# Altium project GameBoard_V1I1.PrjPcb (part 6 of 20)

## Sheet [18] - PCIE MINI.SchDoc
size A2; DocumentNumber: 18; SheetNumber: 18; SheetTotal: 32
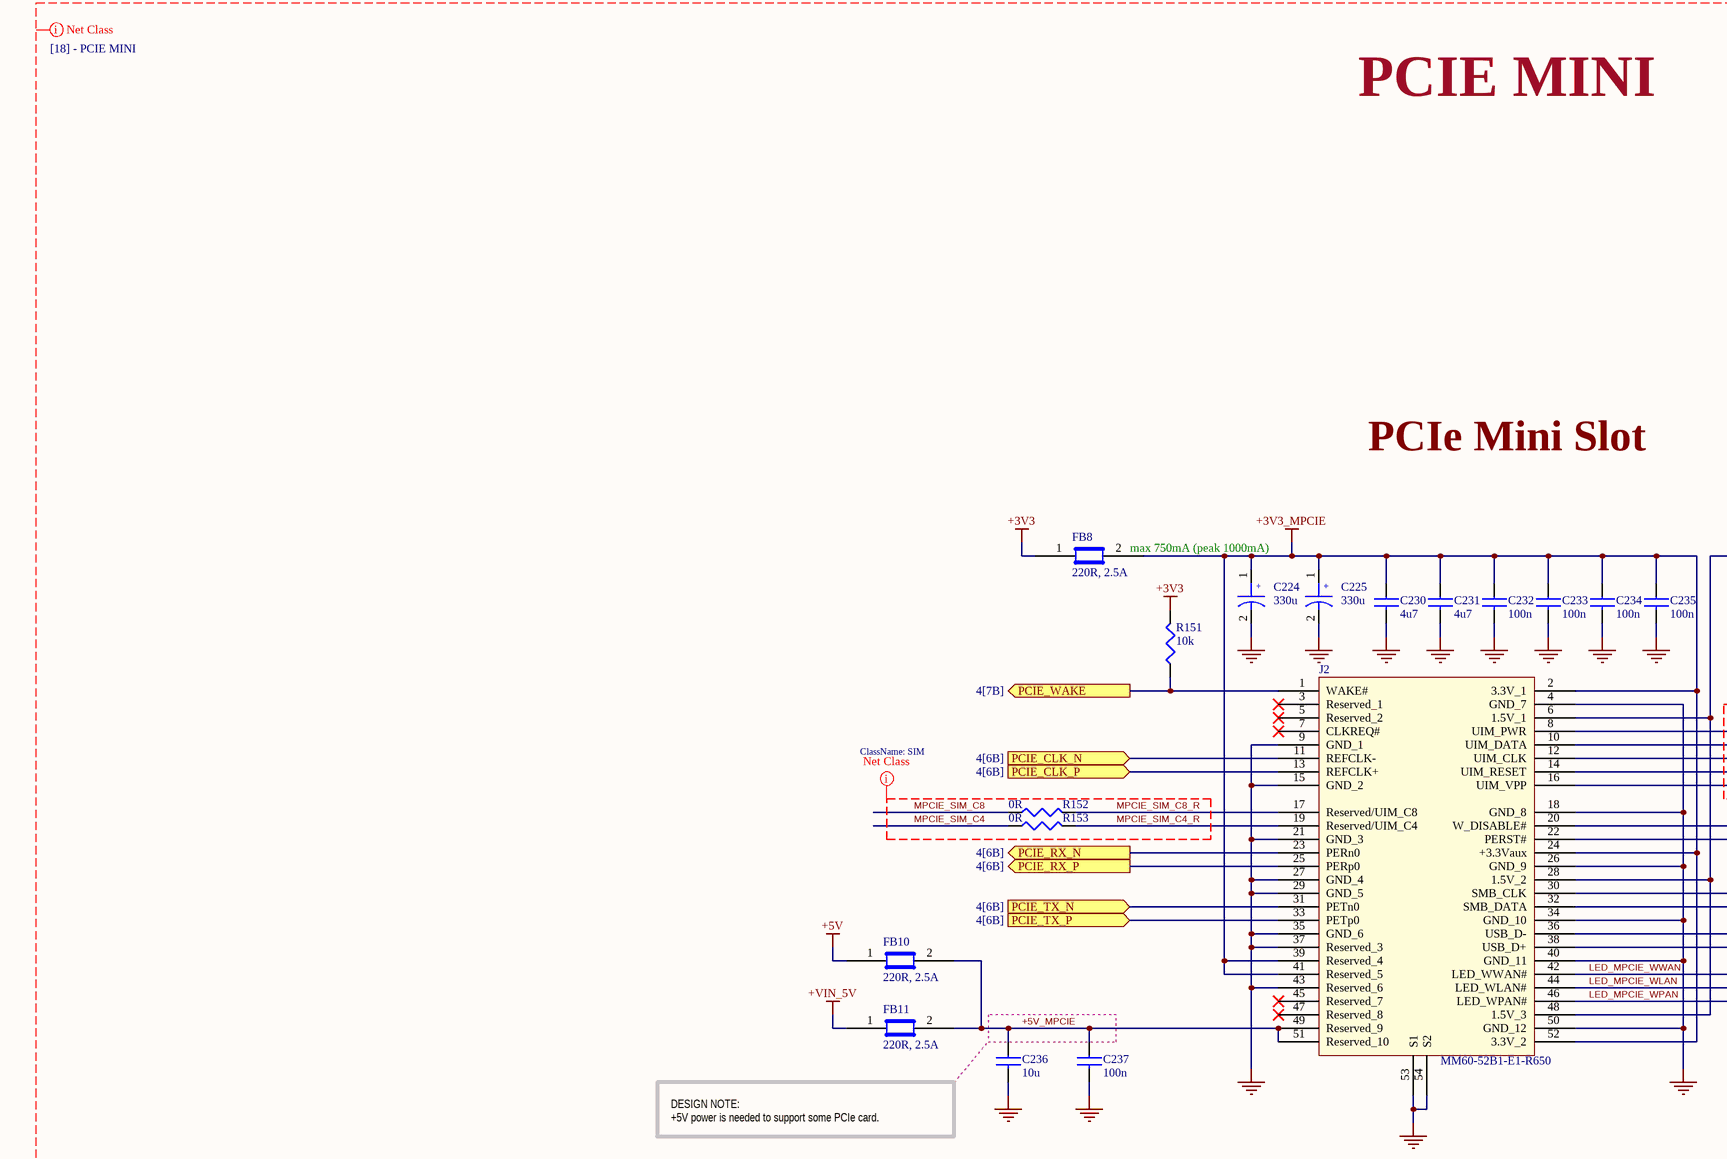
[diagram p37: [18] - PCIE MINI.SchDoc, top left]
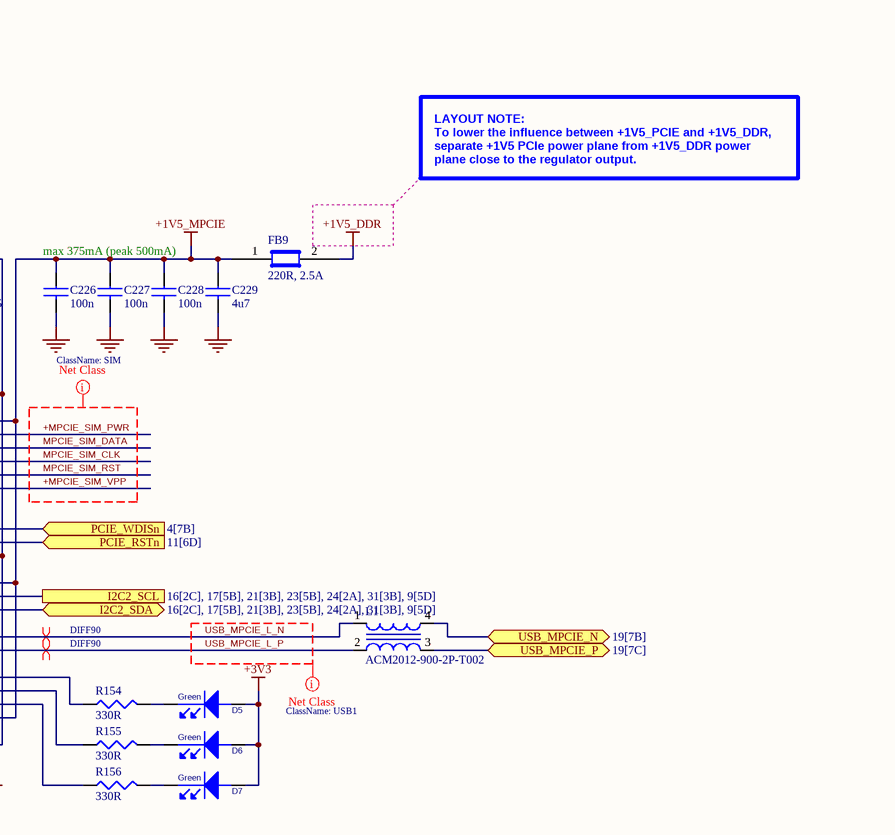
[diagram p38: [18] - PCIE MINI.SchDoc, top right]
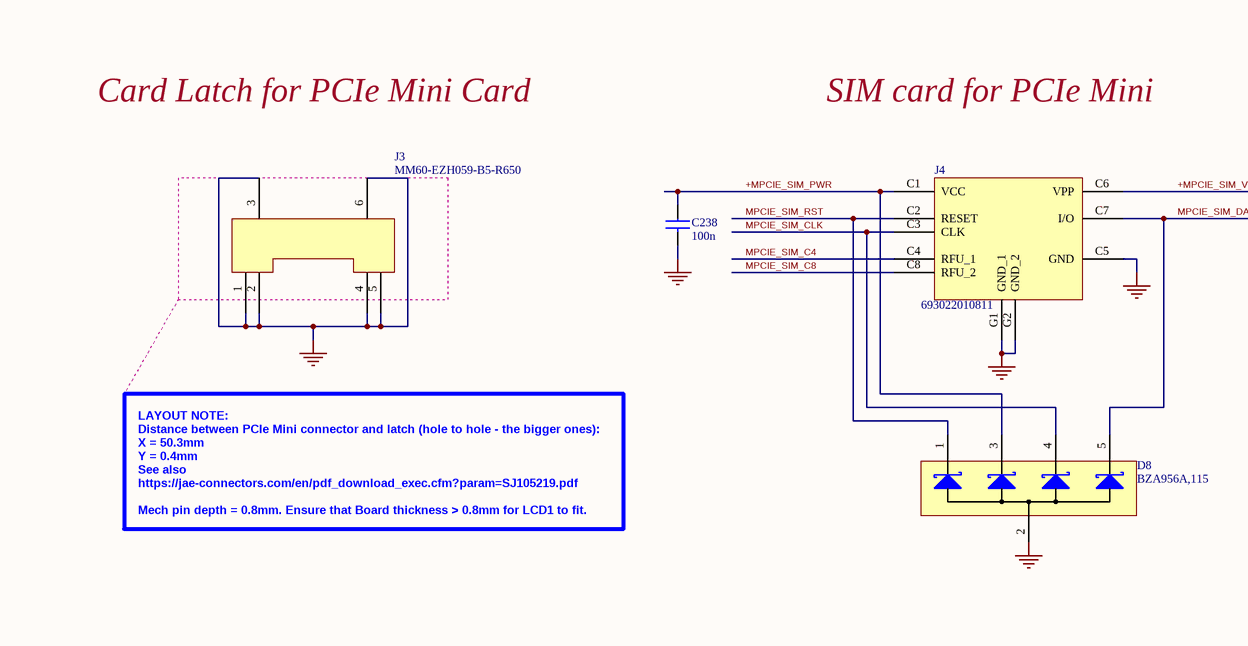
[diagram p39: [18] - PCIE MINI.SchDoc, bottom left]
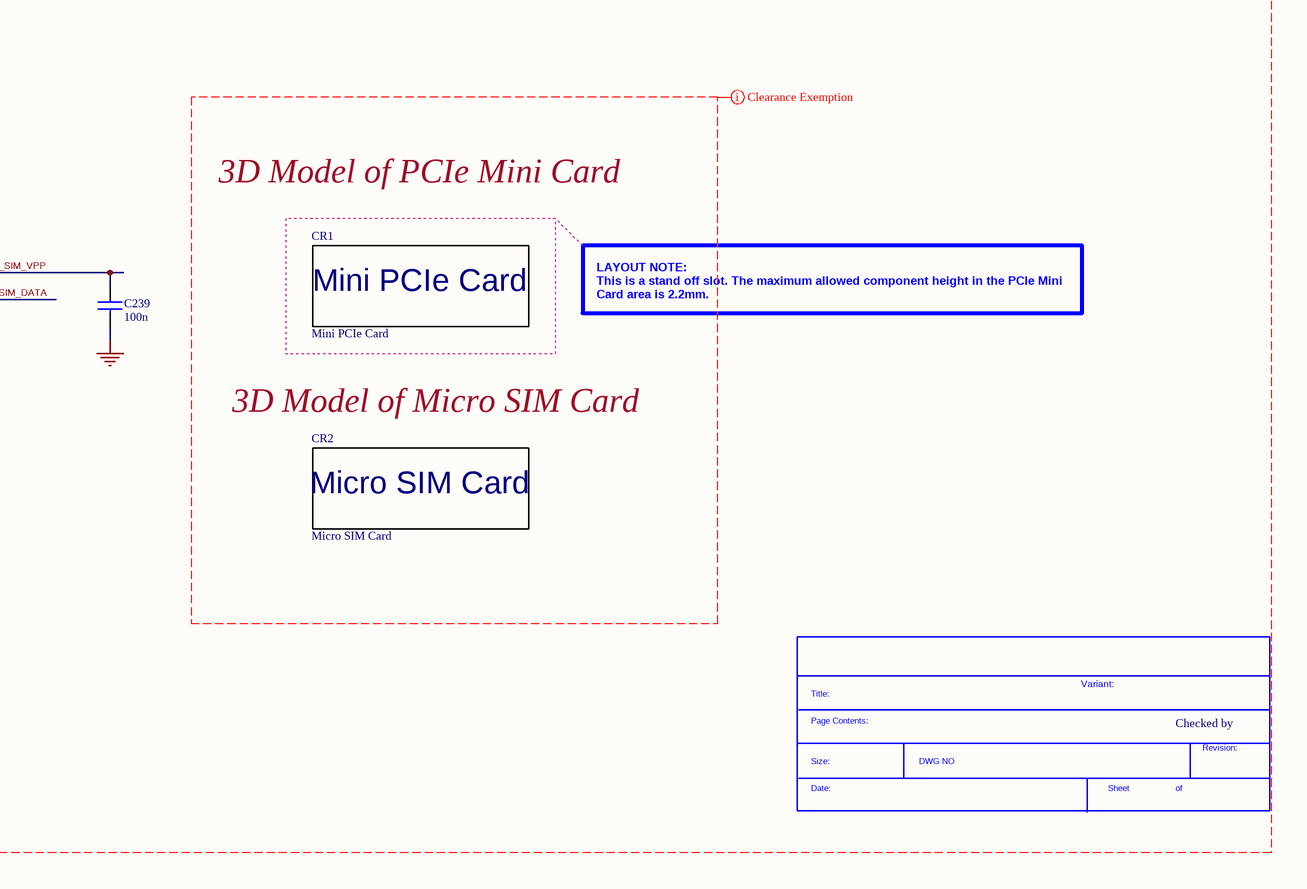
[diagram p40: [18] - PCIE MINI.SchDoc, bottom right]

### Parts
(Parts that share a designator on the sheet are numbered #1, #2 ... from top to bottom, then left to right.)
*#13  SDTitleBlock  (value not drawn)  (graphical)
C224  330u  [C2917]
C225  330u  [C2917]
C226  100n  [C0402]
C227  100n  [C0402]
C228  100n  [C0402]
C229  4u7  [C0402]
C230  4u7  [C0402]
C231  4u7  [C0402]
C232  100n  [C0402]
C233  100n  [C0402]
C234  100n  [C0402]
C235  100n  [C0402]
C236  10u  [C0603]
C237  100n  [C0402]
C238  100n  [C0402]
C239  100n  [C0402]
CR1  Mini PCIe Card  [Mini_PCIe_full card]  (no BOM)
CR2  Micro SIM Card  [Micro_Sim_card]  (no BOM)
D5  Green  [LED_0603]
D6  Green  [LED_0603]
D7  Green  [LED_0603]
D8  BZA956A,115  [SOT665]
FB8  220R, 2.5A  [C0603]
FB9  220R, 2.5A  [C0603]
FB10  220R, 2.5A  [C0603]
FB11  220R, 2.5A  [C0603]
J2  MM60-52B1-E1-R650  [MINI_PCIE_52PIN_CARD_CON]
J3  MM60-EZH059-B5-R650  [MINI_PCIE_52PIN_CARD_LATCH]
J4  693022010811  [SIM_MICRO_HINGED]
L1  ACM2012-900-2P-T002  [ACM2012]
R151  10k  [R0402]
R152  0R  [R0402]
R153  0R  [R0402]
R154  330R  [R0402]
R155  330R  [R0402]
R156  330R  [R0402]

### Ports
I2C2_SCL (see 16[2C], 17[5B], 21[3B], 23[5B], 24[2A], 31[3B], 9[5D]), I2C2_SDA (bidir, see 16[2C], 17[5B], 21[3B], 23[5B], 24[2A], 31[3B], 9[5D]), PCIE_CLK_N (in, see 4[6B]), PCIE_CLK_P (in, see 4[6B]), PCIE_RSTn (in, see 11[6D]), PCIE_RX_N (out, see 4[6B]), PCIE_RX_P (out, see 4[6B]), PCIE_TX_N (in, see 4[6B]), PCIE_TX_P (in, see 4[6B]), PCIE_WAKE (out, see 4[7B]), PCIE_WDISn (in, see 4[7B]), USB_MPCIE_N (bidir, see 19[7B]), USB_MPCIE_P (bidir, see 19[7C])

### Nets
+1V5_DDR: FB9.2
+1V5_MPCIE: C226.1 C227.1 C228.1 C229.1 FB9.1 J2.6(1.5V_1) J2.28(1.5V_2) J2.48(1.5V_3)
+3V3: D5.2(ANODE) D6.2(ANODE) D7.2(ANODE) FB8.1 R151.2
+3V3_MPCIE: C224.1 C225.1 C230.1 C231.1 C232.1 C233.1 C234.1 C235.1 FB8.2 J2.2(3.3V_1) J2.24(+3.3Vaux) J2.39(Reserved_4) J2.41(Reserved_5) J2.52(3.3V_2)
+5V: FB10.1
+VIN_5V: FB11.1
GND: C224.2 C225.2 C226.2 C227.2 C228.2 C229.2 C230.2 C231.2 C232.2 C233.2 C234.2 C235.2 C236.2 C237.2 C238.2 C239.2 D8.2 J2.4(GND_7) J2.9(GND_1) J2.15(GND_2) J2.18(GND_8) J2.21(GND_3) J2.26(GND_9) J2.27(GND_4) J2.29(GND_5) J2.34(GND_10) J2.35(GND_6) J2.37(Reserved_3) J2.40(GND_11) J2.43(Reserved_6) J2.50(GND_12) J2.53(S1) J2.54(S2) J3.1 J3.2 J3.3 J3.4 J3.5 J3.6 J4.C5(GND) J4.G1(GND_1) J4.G2(GND_2)
+5V_MPCIE: C236.1 C237.1 FB10.2 FB11.2 J2.49(Reserved_9) J2.51(Reserved_10)
+MPCIE_SIM_PWR: C238.1 D8.3 J2.8(UIM_PWR) J4.C1(VCC)
+MPCIE_SIM_VPP: C239.1 J2.16(UIM_VPP) J4.C6(VPP)
I2C2_SCL: J2.30(SMB_CLK) ; port I2C2_SCL
I2C2_SDA: J2.32(SMB_DATA) ; port I2C2_SDA
LED_MPCIE_WLAN: J2.44(LED_WLAN#) R155.1
LED_MPCIE_WPAN: J2.46(LED_WPAN#) R156.1
LED_MPCIE_WWAN: J2.42(LED_WWAN#) R154.1
MPCIE_SIM_C4: J4.C4(RFU_1) R153.1
MPCIE_SIM_C4_R: J2.19(Reserved/UIM_C4) R153.2
MPCIE_SIM_C8: J4.C8(RFU_2) R152.1
MPCIE_SIM_C8_R: J2.17(Reserved/UIM_C8) R152.2
MPCIE_SIM_CLK: D8.4 J2.12(UIM_CLK) J4.C3(CLK)
MPCIE_SIM_DATA: D8.5 J2.10(UIM_DATA) J4.C7(I/O)
MPCIE_SIM_RST: D8.1 J2.14(UIM_RESET) J4.C2(RESET)
PCIE_CLK_N: J2.11(REFCLK-) ; port PCIE_CLK_N
PCIE_CLK_P: J2.13(REFCLK+) ; port PCIE_CLK_P
PCIE_RSTn: J2.22(PERST#) ; port PCIE_RSTn
PCIE_RX_N: J2.23(PERn0) ; port PCIE_RX_N
PCIE_RX_P: J2.25(PERp0) ; port PCIE_RX_P
PCIE_TX_N: J2.31(PETn0) ; port PCIE_TX_N
PCIE_TX_P: J2.33(PETp0) ; port PCIE_TX_P
PCIE_WAKE: J2.1(WAKE#) R151.1 ; port PCIE_WAKE
PCIE_WDISn: J2.20(W_DISABLE#) ; port PCIE_WDISn
USB_MPCIE_L_N: J2.36(USB_D-) L1.1
USB_MPCIE_L_P: J2.38(USB_D+) L1.2
USB_MPCIE_N: L1.4 ; port USB_MPCIE_N
USB_MPCIE_P: L1.3 ; port USB_MPCIE_P
NetD5_1: D5.1(cathode) R154.2
NetD6_1: D6.1(cathode) R155.2
NetD7_1: D7.1(cathode) R156.2

Not connected (* = marked no-connect by the designer): J2 3(Reserved_1)* 5(Reserved_2)* 7(CLKREQ#)* 45(Reserved_7)* 47(Reserved_8)*

### Layout directives
differential pair; net class DIFF90: USB_MPCIE_L_N, USB_MPCIE_L_P
net class USB1: USB_MPCIE_L_N, USB_MPCIE_L_P
net class SIM: +MPCIE_SIM_PWR, +MPCIE_SIM_VPP, MPCIE_SIM_C4, MPCIE_SIM_C4_R, MPCIE_SIM_C8, MPCIE_SIM_C8_R, MPCIE_SIM_CLK, MPCIE_SIM_DATA, MPCIE_SIM_RST
net class [18] - PCIE MINI: +1V5_DDR, +1V5_MPCIE, +3V3, +3V3_MPCIE, +5V, +5V_MPCIE, +MPCIE_SIM_PWR, +MPCIE_SIM_VPP, +VIN_5V, GND, LED_MPCIE_WLAN, LED_MPCIE_WPAN, LED_MPCIE_WWAN, MPCIE_SIM_C4, MPCIE_SIM_C4_R, MPCIE_SIM_C8, MPCIE_SIM_C8_R, MPCIE_SIM_CLK, MPCIE_SIM_DATA, MPCIE_SIM_RST, USB_MPCIE_L_N, USB_MPCIE_L_P
rule Component Clearance Constraint [Horizontal Clearance = 0mil    Vertical Clearance = 10mil]: +1V5_DDR, +1V5_MPCIE, +3V3, +3V3_MPCIE, +5V, +5V_MPCIE, +MPCIE_SIM_PWR, +MPCIE_SIM_VPP, +VIN_5V, GND, LED_MPCIE_WLAN, LED_MPCIE_WPAN, LED_MPCIE_WWAN, MPCIE_SIM_C4, MPCIE_SIM_C4_R, MPCIE_SIM_C8, MPCIE_SIM_C8_R, MPCIE_SIM_CLK, MPCIE_SIM_DATA, MPCIE_SIM_RST, USB_MPCIE_L_N, USB_MPCIE_L_P

### Notes on the sheet
- PCIE MINI
- PCIe Mini Slot
- LAYOUT NOTE:
  To lower the influence between +1V5_PCIE and +1V5_DDR, separate +1V5 PCIe power plane from +1V5_DDR power plane close to the regulator output.
- max 750mA (peak 1000mA)
- max 375mA (peak 500mA)
- DESIGN NOTE:
  +5V power is needed to support some PCIe card.
- Card Latch for PCIe Mini Card
- SIM card for PCIe Mini
- 3D Model of PCIe Mini Card
- LAYOUT NOTE:
  This is a stand off slot. The maximum allowed component height in the PCIe Mini Card area is 2.2mm.
- 3D Model of Micro SIM Card
- LAYOUT NOTE:
  Distance between PCIe Mini connector and latch (hole to hole - the bigger ones):
  X = 50.3mm
  Y = 0.4mm
  See also https://jae-connectors.com/en/pdf_download_exec.cfm?param=SJ105219.pdf
  Mech pin depth = 0.8mm. Ensure that Board thickness > 0.8mm for LCD1 to fit.
- Variant:
- Checked by
- (in symbol SDTitleBlock) Title:; Page Contents:; Revision:; Size:; DWG NO; Date:; Sheet; of
- (in symbol T520D337M006ATE045) +

### Library data of the parts
C224 C225 = T520D337M006ATE045: CAP TANT 330UF 6.3V 20% 2917; Manufacturer: Kemet; Manufacturer Size Code: D; Capacitance: 330µF; ESR (Equivalent Series Resistance): 45 mOhm; Type: Molded; .Creator: MM; .Checked PCB: used; Supplier 1: Digi-Key; Manufacturer Part Number: T520D337M006ATE045; RoHS: RoHS Compliant; Category: Capacitors; Stock 1: 11758; Pricing 1: 1=1.33, 10=1.05, 50=0.91, 100=0.7875, 250=0.7 (USD); Packaging: Cut Tape (CT); Voltage - Rated: 6.3V; Tolerance: ±20%; Operating Temperature: -55°C ~ 105°C; Mounting Type: Surface Mount; Package / Case: 2917 (7343 Metric); Size / Dimension: 0.287" L x 0.169" W (7.30mm x 4.30mm); Height - Seated (Max): 0.122" (3.10mm); Lead Spacing: -; Features: Polymer; Lifetime @ Temp.: -; ComponentLink1URL: http://www.kemet.com/kemet/web/homepage/kechome.nsf/file/T520%20Series/$file/KEM_T2015_T520.pdf; ComponentLink1Description: http://www.kemet.com/kemet/web/homepage/kechome.nsf/file/T520%20Series/$file/KEM_T2015_T520.pdf; Supplier Part Number 1: 399-4055-1-ND; .Checked SCH: used
C226-C228 C232-C235 C237-C239 = C1005X5R1H104K: as C98-C102 on sheet [11] - CPU - JTAG, CONTROL; Category: Capacitors; Supplier Part Number: 445-5942-1-ND; Manufacturer Part Number: C1005X5R1H104K; Operating Temperature: -55°C ~ 85°C; Package / Case: 0402 (1005 Metric); Price 1k [$]: 0.02340; .Checked SCH: used; Voltage - Rated: 50V; Supplier: Digikey; Supplier 1: Digi-Key; Supplier Part Number 1: 445-5942-1-ND; RoHS: RoHS Compliant; Stock 1: 106926; Pricing 1: 1=0.27, 10=0.18, 100=0.072, 250=0.05176, 500=0.0369, 1000=0.027 (USD); Tolerance: ±10%; Temperature Coefficient: X5R; Mounting Type: Surface Mount, MLCC; Applications: General Purpose; Ratings: -; Size / Dimension: 0.039" L x 0.020" W (1.00mm x 0.50mm); Height - Seated (Max): -; Thickness (Max): 0.022" (0.55mm); Lead Spacing: -; Features: -; Packaging: Cut Tape (CT); Lead Style: -; ComponentLink1URL: http://www.tdk.co.jp/tefe02/e412_c.pdf; ComponentLink1Description: http://www.tdk.co.jp/tefe02/e412_c.pdf; Supplier 2: Digi-Key; Supplier Part Number 2: 311-1697-6-ND
C229-C231 = C1005X5R1A475M: CAP CER 4.7UF 10V 20% X5R 0402; Manufacturer: TDK Corporation; Capacitance: 4.7µF; .Checked PCB: used; Supplier 1: Digi-Key; Supplier Part Number 1: 445-8023-1-ND; Manufacturer Part Number: C1005X5R1A475M; RoHS: RoHS Compliant; Category: Capacitors; Stock 1: 10140; Pricing 1: 1=0.53, 10=0.415, 100=0.25, 250=0.18752, 500=0.16, 1000=0.125, 5000=0.095 (USD); Voltage - Rated: 10V; Tolerance: ±20%; Temperature Coefficient: X5R; Mounting Type: Surface Mount, MLCC; Operating Temperature: -55°C ~ 85°C; Applications: General Purpose; Ratings: -; Package / Case: 0402 (1005 Metric); Size / Dimension: 0.039" L x 0.020" W (1.00mm x 0.50mm); Height - Seated (Max): -; Thickness (Max): -; Lead Spacing: -; Features: -; Packaging: Cut Tape (CT); Lead Style: -; ComponentLink1URL: http://www.tdk.com/pdf/general_B11.pdf; ComponentLink1Description: http://www.tdk.com/pdf/general_B11.pdf; .Checked SCH: used
C236 = C1608X5R0J106M: CAP CER 10UF 6.3V X5R 20% 0603; Manufacturer: TDK Corporation; Capacitance: 10µF; Value: 10µF; .Checked PCB: used; Category: Capacitors; Supplier Part Number: 445-4112-1-ND; Manufacturer Part Number: C1608X5R0J106M; Operating Temperature: -55°C ~ 85°C; Package / Case: 0603 (1608 Metric); Price 1k [$]: 0.08580; .Checked SCH: used; Voltage - Rated: 6.3V; Features: Low ESR; Supplier: Digikey; Supplier 1: Digi-Key; Supplier Part Number 1: 445-4112-1-ND; RoHS: RoHS Compliant; Stock 1: 48157; Pricing 1: 1=0.46, 10=0.363, 100=0.1898, 250=0.14024, 500=0.1089, 1000=0.0858 (USD); Tolerance: ±20%; Temperature Coefficient: X5R; Mounting Type: Surface Mount, MLCC; Applications: General Purpose; Ratings: -; Size / Dimension: 0.063" L x 0.031" W (1.60mm x 0.80mm); Height - Seated (Max): -; Thickness (Max): 0.037" (0.95mm); Lead Spacing: -; Packaging: Cut Tape (CT); Lead Style: -; ComponentLink1URL: http://www.tdk.com/pdf/general_B11.pdf; ComponentLink1Description: http://www.tdk.com/pdf/general_B11.pdf
CR1 = Card_Mini_PCIe: Card MIni PCIe; .Creator: MM; .Checked PCB: used; Category: Card; .Checked SCH: used
CR2 = Card_Micro_SIM: Card Micro SIM; .Creator: MM; .Checked PCB: used; Category: Card; .Checked SCH: used
D5-D7 = LG L29K-G2J1-24-Z: LED SMARTLED GREEN 570NM 0603; Manufacturer: OSRAM Opto Semiconductors Inc; .Checked PCB: used; Current - Test: 2mA; Voltage - Forward (Vf) Typ: 1.7V; Luminous Flux @ Current - Test: 12 mlm; Millicandela Rating: 3.92mcd; Wavelength - Peak: 572nm; Lens Type: Diffused; Lens Style/Size: Rectangle with Flat Top, 1.3mm x 0.8mm; Viewing Angle: 160°; Regulator Topology: Positive Fixed; Voltage - Output: 2.5V; Voltage - Input: 2.6 V ~ 6 V; Voltage - Dropout (Typical): 0.16V @ 500mA; Number of Regulators: 1; Current - Output: 500mA; Current - Limit (Min): 600mA; .Checked SCH: used; Category: Optoelectronics; Supplier Part Number: 475-2709-1-ND; Family: LEDs - <75mA, Discre; Manufacturer Part Number: LG L29K-G2J1-24-Z; Price 1k [$]: 0.08744; Value: Green; Color: Green; Package / Case: 0603 (1608 Metric); Supplier: Digikey; Supplier 1: Digi-Key; Supplier Part Number 1: 475-2709-1-ND; RoHS: RoHS Compliant; Stock 1: 30318; Pricing 1: 1=0.16, 10=0.137, 100=0.1093, 250=0.09564, 500=0.08744 (USD); Wavelength - Dominant: 570nm; Size / Dimension: 1.70mm L x 0.80mm W; Height: 0.65mm; Mounting Type: Surface Mount; Packaging: Cut Tape (CT); ComponentLink1URL: http://catalog.osram-os.com/catalogue/catalogue.do;jsessionid=32CB61882C089EDD4B6D0A54E7E1F117?act=downloadFile&favOid=020000020000138e000100b6; ComponentLink1Description: http://catalog.osram-os.com/catalogue/catalogue.do;jsessionid=32CB61882C089EDD4B6D0A54E7E1F117?act=downloadFile&favOid=020000020000138e000100b6; Operating Temperature: -40°C ~ 125°C; Supplier Device Package: 6-TMLF® (1.6x1.6); ComponentLink2URL: http://www.micrel.com/_PDF/mic5353.pdf; ComponentLink2Description: http://www.micrel.com/_PDF/mic5353.pdf
D8 = BZA956A,115: TVS ZENER QUAD 5.6V SOT665; Manufacturer: NXP Semiconductors; Voltage - Reverse Standoff (Typ): 3V; Voltage - Breakdown: 5.32V; Power (Watts): 16W; Polarization: 4 Channel Array - Unidirectional; .Creator: MM; .Checked PCB: used; Supplier 1: Digi-Key; Manufacturer Part Number: BZA956A,115; RoHS: RoHS Compliant; Category: Circuit Protection; Packaging: Cut Tape (CT); Mounting Type: Surface Mount; Package / Case: SOT-665; Supplier Device Package: SOT-665; ComponentLink1URL: http://www.nxp.com/documents/data_sheet/BZA900A_SERIES.pdf; ComponentLink1Description: http://www.nxp.com/documents/data_sheet/BZA900A_SERIES.pdf; Supplier Part Number 1: 1727-5529-1-ND; .Checked SCH: used
FB8-FB11 = BLM18SG221TN1D: FERRITE CHIP 220 OHM 2500MA 0603; Manufacturer: Murata Electronics North America; Impedance @ Frequency: 220 Ohm @ 100MHz; DC Resistance (DCR): 40 mOhm Max; Filter Type: Differential Mode - Single; Number of Lines: 1; .Checked PCB: used; Supplier 1: Digi-Key; Supplier Part Number 1: 490-5225-1-ND; Manufacturer Part Number: BLM18SG221TN1D; RoHS: RoHS Compliant; Category: Filters; Stock 1: 54640; Pricing 1: 1=0.38, 10=0.282, 50=0.1646, 100=0.1316, 250=0.094, 500=0.06392, 1000=0.0517, 5000=0.04042 (USD); Current Rating: 2.5A; Package / Case: 0603 (1608 Metric); Mounting Type: Surface Mount; Packaging: Cut Tape (CT); Height (Max): 0.037" (0.95mm); Size / Dimension: 0.063" L x 0.031" W (1.60mm x 0.80mm); ComponentLink1URL: http://search.murata.co.jp/Ceramy/image/img/PDF/ENG/L0110S0100BLM18S.pdf; ComponentLink1Description: http://search.murata.co.jp/Ceramy/image/img/PDF/ENG/L0110S0100BLM18S.pdf; .Checked SCH: used
J2 = MM60-52B1-E1-R650: CONN MINI EXPRESS CARD 52POS SMD; Manufacturer: JAE Electronics; Card Type: PCI Express Mini Card; Gender: Female; Number of Positions: 52; Card Thickness: 0.039" (1.00mm); Pitch: 0.031" (0.80mm); Material - Insulation: Thermoplastic; Read Out: Dual; .Creator: MM; .Checked PCB: used; Supplier 1: Digi-Key; Manufacturer Part Number: MM60-52B1-E1-R650; RoHS: RoHS Compliant; Category: Connectors, Interconnects; Stock 1: 470; Pricing 1: 1=2.16, 10=1.962, 25=1.842, 100=1.6817, 250=1.52152 (USD); Packaging: Cut Tape (CT); Number of Positions/Bay/Row: -; Number of Rows: 2; Features: Board Guide; Mounting Type: Surface Mount, Right Angle; Termination: Solder; Contact Material: Copper Alloy; Contact Finish: Gold; Contact Finish Thickness: 4µin (0.10µm); Contact Type: -; Color: -; Flange Feature: -; Operating Temperature: -40°C ~ 85°C; ComponentLink1URL: http://jae-connectors.com/en/pdf/JACS-10313_MM60.pdf; ComponentLink1Description: http://jae-connectors.com/en/pdf/JACS-10313_MM60.pdf; Supplier Part Number 1: 670-2275-1-ND; .Checked SCH: used
J3 = MM60-EZH059-B5-R650: CONN MINI EXPRESS CARD LATCH SMD; Manufacturer: JAE Electronics; For Use With/Related Products: PCI Express Mini Card; .Creator: MM; .Checked PCB: used; Supplier 1: Digi-Key; Manufacturer Part Number: MM60-EZH059-B5-R650; RoHS: RoHS Compliant; Category: Connectors, Interconnects; Stock 1: 4853; Pricing 1: 1=1.22, 10=1.075, 25=1.0116, 100=0.9272, 250=0.84292 (USD); Packaging: Cut Tape (CT); Accessory Type: Latch; ComponentLink1URL: http://jae-connector.com/en/pdf/SJ105221.pdf; ComponentLink1Description: http://jae-connector.com/en/pdf/SJ105221.pdf; Supplier Part Number 1: 670-2277-1-ND; .Checked SCH: used
J4 = 693022010811: CONN SMART CARD; Manufacturer: Wurth Electronics Inc; Card Type: Micro SIM; Number of Positions: 8; Connector Type: Connector and Ejector; Insertion, Removal Method: Hinged Lid; .Creator: MM; .Checked PCB: used; Supplier 1: Digi-Key; Manufacturer Part Number: 693022010811; RoHS: RoHS Compliant; Category: Connectors, Interconnects; Stock 1: 1977; Pricing 1: 1=1.94, 10=1.74, 50=1.61, 100=1.48, 500=1.29 (USD); Packaging: Cut Tape (CT); Ejector Side: -; Mounting Type: Surface Mount, Right Angle; Features: Shielded; Height Above Board: 0.077" (1.95mm); Mounting Feature: Normal, Standard - Top; Contact Finish: Gold; Contact Finish Thickness: -; ComponentLink1URL: http://katalog.we-online.de/em/datasheet/693022010811.pdf; ComponentLink1Description: http://katalog.we-online.de/em/datasheet/693022010811.pdf; Supplier Part Number 1: 732-5957-1-ND; .Checked SCH: used
L1 = ACM2012-900-2P-T002: CHOKE COMM MODE 90 OHM .4A SMD; Manufacturer: TDK Corporation; Filter Type: Data, Signal Line; Number of Lines: 2; Current: 400mA; DC Resistance (DCR): 190 mOhm Max; Impedance: 90 Ohm; Resistance (Ohms): 8.2K; Power (Watts): 0.063W, 1/16W; Temperature Coefficient: ±100ppm/°C; Tolerance: ±1%; .Checked PCB: used; Supplier 1: Digi-Key; Supplier Part Number 1: 445-2207-1-ND; Manufacturer Part Number: ACM2012-900-2P-T002; RoHS: RoHS Compliant; Category: Filters; Stock 1: 175768; Pricing 1: 1=0.48, 10=0.448, 50=0.42, 100=0.364, 500=0.308, 1000=0.252 (USD); Inductance: -; Mounting Type: Surface Mount; Size / Dimension: 0.079" L x 0.047" W (2.00mm x 1.20mm); Height (Max): 0.051" (1.30mm); Package / Case: 0805 (2012 Metric), 4 Lead; Operating Temperature: -25°C ~ 85°C; Packaging: Cut Tape (CT); ComponentLink1URL: http://www.tdk.co.jp/tefe02/e9719_acm2012.pdf; ComponentLink1Description: http://www.tdk.co.jp/tefe02/e9719_acm2012.pdf; Composition: Thick Film; Features: -; Height: 0.016" (0.40mm); Number of Terminations: 2; ComponentLink2URL: http://www.yageo.com/documents/recent/PYu-RC0402_51_RoHS_L_6.pdf; ComponentLink2Description: http://www.yageo.com/documents/recent/PYu-RC0402_51_RoHS_L_6.pdf; .Checked SCH: used; Supplier 2: Digi-Key; Supplier Part Number 2: SRF2012-900YACT-ND
R151 = RC0402FR-0710KL: as R66 on sheet [11] - CPU - JTAG, CONTROL; Category: Resistors; Supplier Part Number: 311-10.0KLRCT-ND; Manufacturer Part Number: RC0402FR-0710KL; Package / Case: 0402 (1005 Metric); Price 1k [$]: 0.01421; Resistance (Ohms): 10K; Tolerance: ±1%; Value: 10k; .Checked SCH: used; Supplier: Digikey; Supplier 1: Digi-Key; Supplier Part Number 1: 311-10.0KLRCT-ND; RoHS: RoHS Compliant; Stock 1: 2916495; Pricing 1: 10=0.014, 50=0.0104, 100=0.0079, 250=0.00584, 500=0.00432, 1000=0.00288 (USD); Composition: Thick Film; Features: -; Size / Dimension: 0.039" L x 0.020" W (1.00mm x 0.50mm); Height: 0.016" (0.40mm); Number of Terminations: 2; Packaging: Cut Tape (CT); ComponentLink1URL: http://www.yageo.com/documents/recent/PYu-RC0402_51_RoHS_L_6.pdf; ComponentLink1Description: http://www.yageo.com/documents/recent/PYu-RC0402_51_RoHS_L_6.pdf
R152 R153 = RC0402JR-070RL: as R93 on sheet [11] - CPU - JTAG, CONTROL; Category: Resistors; Manufacturer Part Number: RC0402JR-070RL; Package / Case: 0402 (1005 Metric); Price 1k [$]: 0.01389; Value: 0R; .Checked SCH: used; Supplier Part Number: 311-0.0JRCT-ND; Supplier: Digikey; Supplier 1: Digi-Key; Supplier Part Number 1: 311-0.0JRCT-ND; RoHS: RoHS Compliant; Stock 1: 1106330; Pricing 1: 10=0.012, 50=0.009, 100=0.0069, 250=0.00512, 500=0.0038, 1000=0.00253 (USD); Composition: Thick Film; Features: -; Temperature Coefficient: -; Size / Dimension: 0.039" L x 0.020" W (1.00mm x 0.50mm); Height: 0.016" (0.40mm); Number of Terminations: 2; Packaging: Cut Tape (CT); ComponentLink1URL: http://www.yageo.com/documents/recent/PYu-RC0402_51_RoHS_L_6.pdf; ComponentLink1Description: http://www.yageo.com/documents/recent/PYu-RC0402_51_RoHS_L_6.pdf
R154-R156 = CRCW0402330RFKED: RES 330 OHM 1/16W 1% 0402 SMD; Manufacturer: Vishay Dale; Resistance (Ohms): 330; Power (Watts): 0.063W, 1/16W; Temperature Coefficient: ±100ppm/°C; .Checked PCB: used; Supplier 1: Digi-Key; Supplier Part Number 1: 541-330LCT-ND; Manufacturer Part Number: CRCW0402330RFKED; RoHS: RoHS Compliant; Category: Resistors; Stock 1: 49303; Pricing 1: 10=0.083, 50=0.0444, 200=0.0255, 1000=0.0174 (USD); Composition: Thick Film; Features: -; Tolerance: ±1%; Package / Case: 0402 (1005 Metric); Size / Dimension: 0.039" L x 0.020" W (1.00mm x 0.50mm); Height: 0.016" (0.40mm); Number of Terminations: 2; Packaging: Cut Tape (CT); ComponentLink1URL: http://www.vishay.com/doc?20035; ComponentLink1Description: http://www.vishay.com/doc?20035; .Checked SCH: used

## Sheet [13] - CPU - UNUSED.SchDoc
size A2; DocumentNumber: 13; SheetNumber: 13; SheetTotal: 32
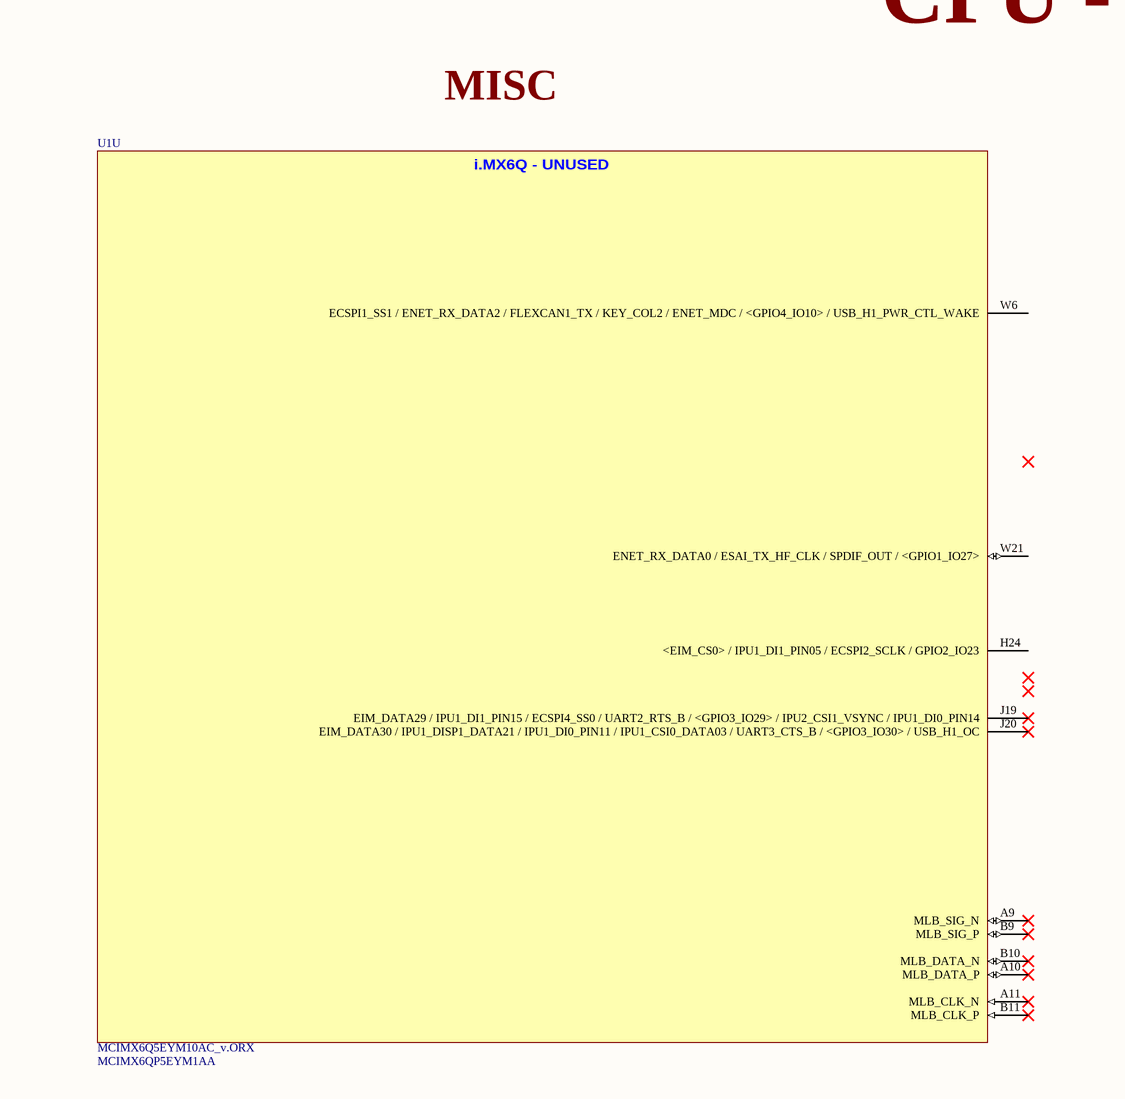
[diagram p41: [13] - CPU - UNUSED.SchDoc, top left]
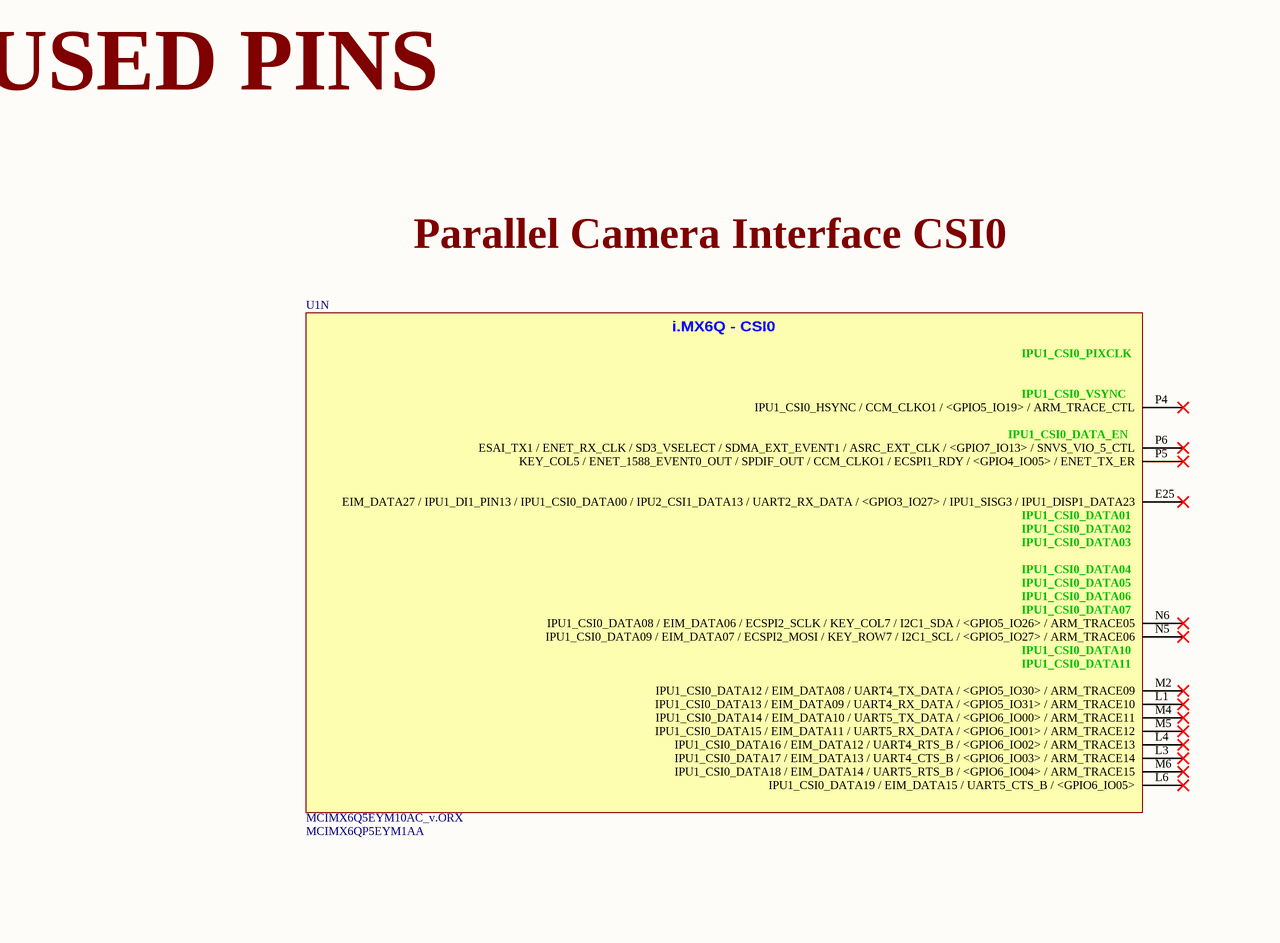
[diagram p42: [13] - CPU - UNUSED.SchDoc, top right]
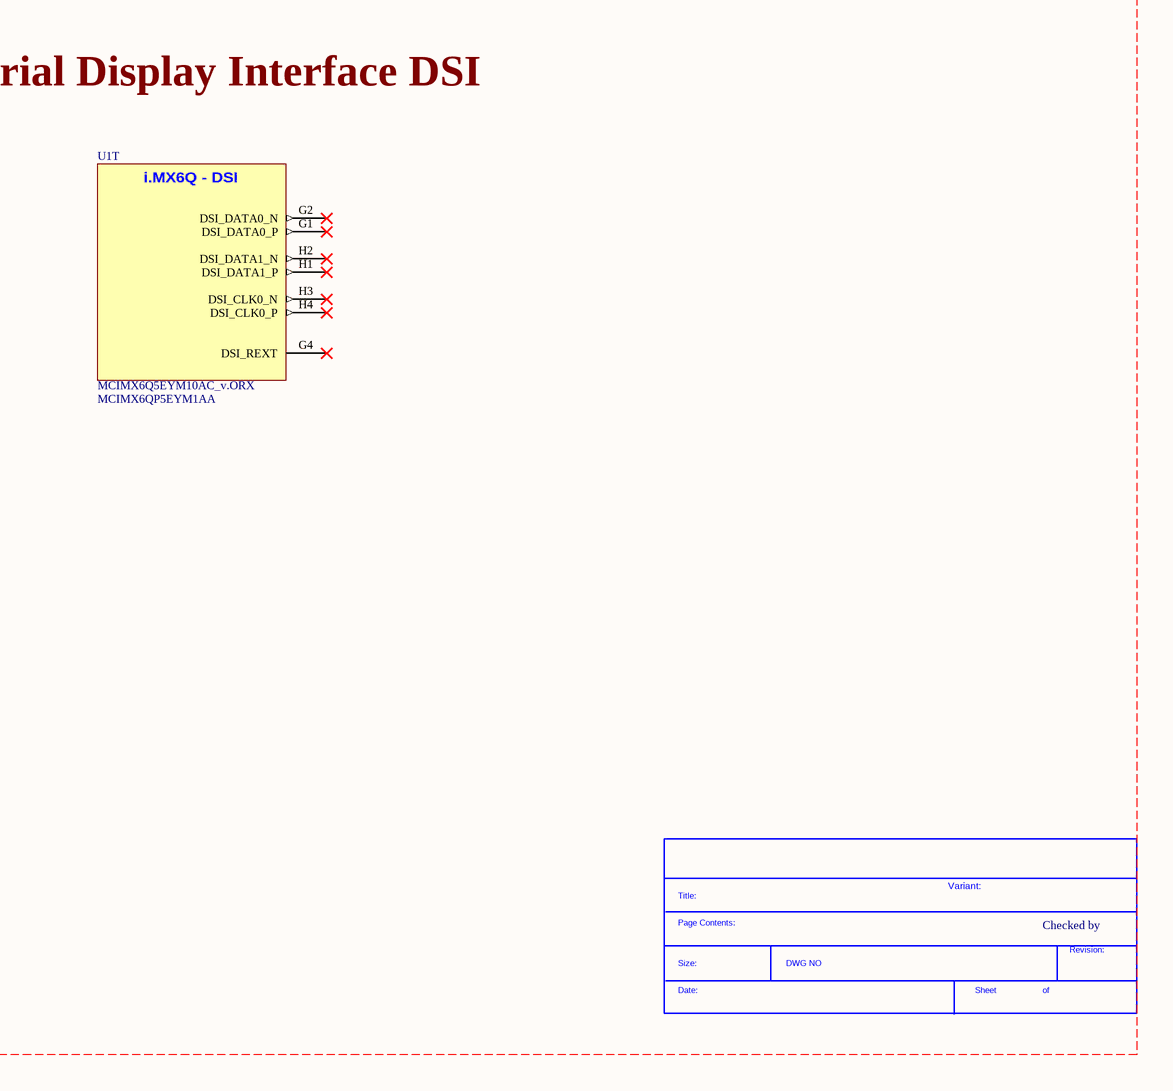
[diagram p43: [13] - CPU - UNUSED.SchDoc, bottom right]

### Parts
(Parts that share a designator on the sheet are numbered #1, #2 ... from top to bottom, then left to right.)
*#14  SDTitleBlock  (value not drawn)  (graphical)
U1  MCIMX6Q5EYM10AC_v.ORX  Supplier Part Number 2: MCIMX6QP5EYM1AA  [PBGA624]  (parts N,T,U of 23)

### Nets

Not connected (* = marked no-connect by the designer): U1 A9(MLB_SIG_N)* A10(MLB_DATA_P)* A11(MLB_CLK_N)* B9(MLB_SIG_P)* B10(MLB_DATA_N)* B11(MLB_CLK_P)* E25(EIM_DATA27_/_IPU1_DI1_PIN13_/_IPU1_CSI0_DATA00_/_IPU2_CSI1_DATA13_/_UART2_RX_DATA_/_<GPIO3_IO27>_/_IPU1_SISG3_/_IPU1_DISP1_DATA23)* G1(DSI_DATA0_P)* G2(DSI_DATA0_N)* G4(DSI_REXT)* H1(DSI_DATA1_P)* H2(DSI_DATA1_N)* H3(DSI_CLK0_N)* H4(DSI_CLK0_P)* H24(<EIM_CS0>_/_IPU1_DI1_PIN05_/_ECSPI2_SCLK_/_GPIO2_IO23) J19(EIM_DATA29_/_IPU1_DI1_PIN15_/_ECSPI4_SS0_/_UART2_RTS_B_/_<GPIO3_IO29>_/_IPU2_CSI1_VSYNC_/_IPU1_DI0_PIN14)* J20(EIM_DATA30_/_IPU1_DISP1_DATA21_/_IPU1_DI0_PIN11_/_IPU1_CSI0_DATA03_/_UART3_CTS_B_/_<GPIO3_IO30>_/_USB_H1_OC)* L1(IPU1_CSI0_DATA13_/_EIM_DATA09_/_UART4_RX_DATA_/_<GPIO5_IO31>_/_ARM_TRACE10)* L3(IPU1_CSI0_DATA17_/_EIM_DATA13_/_UART4_CTS_B_/_<GPIO6_IO03>_/_ARM_TRACE14)* L4(IPU1_CSI0_DATA16_/_EIM_DATA12_/_UART4_RTS_B_/_<GPIO6_IO02>_/_ARM_TRACE13)* L6(IPU1_CSI0_DATA19_/_EIM_DATA15_/_UART5_CTS_B_/_<GPIO6_IO05>)* M2(IPU1_CSI0_DATA12_/_EIM_DATA08_/_UART4_TX_DATA_/_<GPIO5_IO30>_/_ARM_TRACE09)* M4(IPU1_CSI0_DATA14_/_EIM_DATA10_/_UART5_TX_DATA_/_<GPIO6_IO00>_/_ARM_TRACE11)* M5(IPU1_CSI0_DATA15_/_EIM_DATA11_/_UART5_RX_DATA_/_<GPIO6_IO01>_/_ARM_TRACE12)* M6(IPU1_CSI0_DATA18_/_EIM_DATA14_/_UART5_RTS_B_/_<GPIO6_IO04>_/_ARM_TRACE15)* N5(IPU1_CSI0_DATA09_/_EIM_DATA07_/_ECSPI2_MOSI_/_KEY_ROW7_/_I2C1_SCL_/_<GPIO5_IO27>_/_ARM_TRACE06)* N6(IPU1_CSI0_DATA08_/_EIM_DATA06_/_ECSPI2_SCLK_/_KEY_COL7_/_I2C1_SDA_/_<GPIO5_IO26>_/_ARM_TRACE05)* P4(IPU1_CSI0_HSYNC_/_CCM_CLKO1_/_<GPIO5_IO19>_/_ARM_TRACE_CTL)* P5(KEY_COL5_/_ENET_1588_EVENT0_OUT_/_SPDIF_OUT_/_CCM_CLKO1_/_ECSPI1_RDY_/_<GPIO4_IO05>_/_ENET_TX_ER)* P6(ESAI_TX1_/_ENET_RX_CLK_/_SD3_VSELECT_/_SDMA_EXT_EVENT1_/_ASRC_EXT_CLK_/_<GPIO7_IO13>_/_SNVS_VIO_5_CTL)* W6(ECSPI1_SS1_/_ENET_RX_DATA2_/_FLEXCAN1_TX_/_KEY_COL2_/_ENET_MDC_/_<GPIO4_IO10>_/_USB_H1_PWR_CTL_WAKE) W21(ENET_RX_DATA0_/_ESAI_TX_HF_CLK_/_SPDIF_OUT_/_<GPIO1_IO27>)

### Layout directives
net class [13] - CPU - UNUSED: (no net found under the mark)

### Notes on the sheet
- CPU - UNUSED PINS
- MISC
- Parallel Camera Interface CSI0
- Serial Display Interface DSI
- Variant:
- Checked by
- (in symbol MCIMX6Q5EYM10AC_v.ORX, part N) i.MX6Q - CSI0; IPU1_CSI0_PIXCLK; IPU1_CSI0_VSYNC; IPU1_CSI0_DATA_EN; IPU1_CSI0_DATA01; IPU1_CSI0_DATA02; IPU1_CSI0_DATA03; IPU1_CSI0_DATA04; IPU1_CSI0_DATA05; IPU1_CSI0_DATA06; IPU1_CSI0_DATA07; IPU1_CSI0_DATA10; IPU1_CSI0_DATA11
- (in symbol MCIMX6Q5EYM10AC_v.ORX, part T) i.MX6Q - DSI
- (in symbol MCIMX6Q5EYM10AC_v.ORX, part U) i.MX6Q - UNUSED
- (in symbol SDTitleBlock) Title:; Page Contents:; Revision:; Size:; DWG NO; Date:; Sheet; of

### Library data of the parts
U1 = MCIMX6Q5EYM10AC_v.ORX: as U1 on sheet [11] - CPU - JTAG, CONTROL; Supplier 1: Digi-Key; Manufacturer Part Number: MCIMX6Q5EYM10AC; RoHS: RoHS Compliant; Category: Integrated Circuits (ICs); Stock 1: 0; Pricing 1: 1=54.98, 10=51.922, 25=48.868, 100=30.5424 (USD); Program Memory Size: -; EEPROM Size: -; Data Converters: -; Operating Temperature: -20°C ~ 105°C; Package / Case: 624-FBGA, FCBGA; Packaging: Tray; ComponentLink1URL: http://cache.freescale.com/files/32bit/doc/data_sheet/IMX6DQCEC.pdf; ComponentLink1Description: Data Sheet; Supplier Part Number 1: MCIMX6Q5EYM10AC-ND; .Checked SCH: used; ComponentLink2Description: User Guide; ComponentLink2URL: file:///C:/Users/mbeach/Downloads/i.MX_Linux_User's_Guide.pdf; Supplier 2: Arrow